# Altium schematic sheet DSPComm.SchDoc
size A4
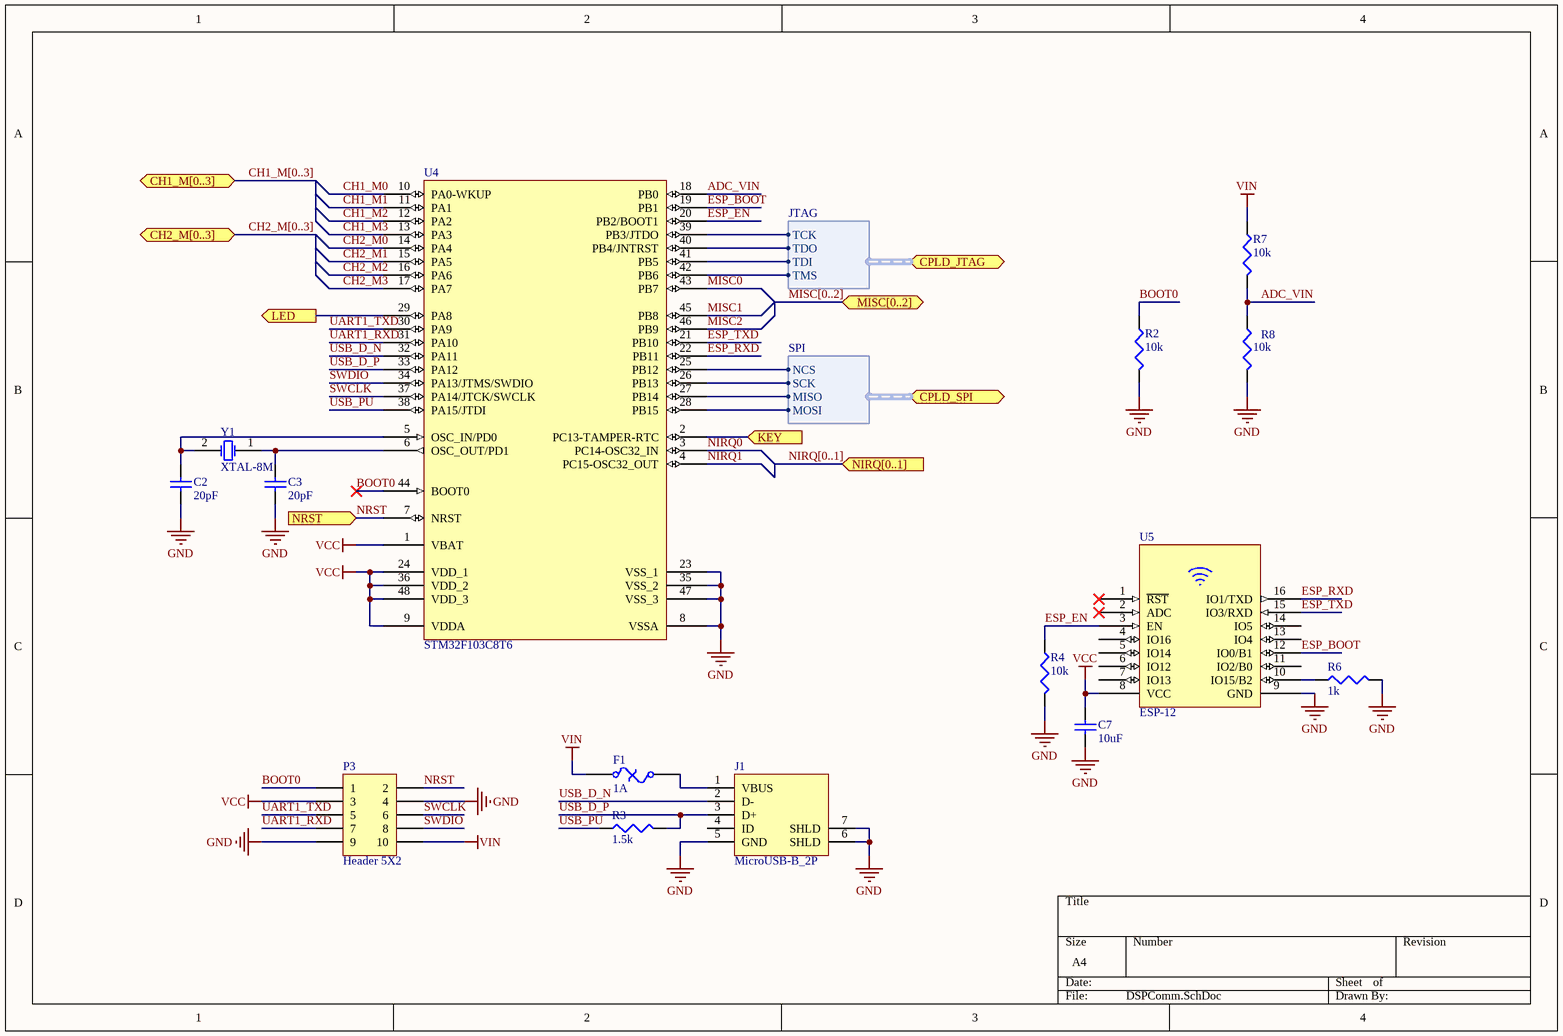
[diagram p0: DSPComm.SchDoc]

## Parts
C2  value 20pF  [0603C]  (hidden comment: Cap)
C3  value 20pF  [0603C]  (hidden comment: Cap)
C7  value 10uF  [0805C]  (hidden comment: Cap)
F1  1A  [1206F]
J1  MicroUSB-B_2P  [MICRO-USB-B-2P]
P3  Header 5X2  [HDR2X5]
R2  value 10k  [0603R]  (hidden comment: Res3)
R3  value 1.5k  [0603R]  (hidden comment: Res3)
R4  value 10k  [0603R]  (hidden comment: Res3)
R6  value 1k  [0603R]  (hidden comment: Res3)
R7  value 10k  [0603R]  (hidden comment: Res3)
R8  value 10k  [0603R]  (hidden comment: Res3)
U4  STM32F103C8T6  [LQFP48_M]
U5  ESP-12  [ESP-12]
Y1  XTAL-8M  [XTAL_5032_2P]

## Ports
CH1_M[0..3] (bidir), CH2_M[0..3] (bidir), CPLD_JTAG (harness JTAG), CPLD_SPI (harness SPI), KEY (in), LED (out), MISC[0..2] (bidir), NIRQ[0..1] (in), NRST (in)

## Harnesses
JTAG: TDI, TDO, TCK, TMS
SPI: MOSI, MISO, SCK, NCS

## Nets
GND: C2.1 C3.1 C7.2 J1.5(GND) J1.6(SHLD) J1.7(SHLD) P3.4 P3.9 R2.2 R4.2 R6.2 R8.2 U4.8(VSSA) U4.23(VSS_1) U4.35(VSS_2) U4.47(VSS_3) U5.9(GND)
VCC: C7.1 P3.3 U4.1(VBAT) U4.9(VDDA) U4.24(VDD_1) U4.36(VDD_2) U4.48(VDD_3) U5.8(VCC)
VIN: F1.1 P3.10 R7.1
ADC_VIN: R7.2 R8.1 U4.18(PB0)
BOOT0: P3.1 R2.1 U4.44(BOOT0)
CH1_M0: U4.10(PA0-WKUP)
CH1_M1: U4.11(PA1)
CH1_M2: U4.12(PA2)
CH1_M3: U4.13(PA3)
CH2_M0: U4.14(PA4)
CH2_M1: U4.15(PA5)
CH2_M2: U4.16(PA6)
CH2_M3: U4.17(PA7)
ESP_BOOT: U4.19(PB1) U5.12(IO0/B1)
ESP_EN: R4.1 U4.20(PB2/BOOT1) U5.3(EN)
ESP_RXD: U4.22(PB11) U5.16(IO1/TXD)
ESP_TXD: U4.21(PB10) U5.15(IO3/RXD)
KEY: U4.2(PC13-TAMPER-RTC) ; port KEY
LED: U4.29(PA8) ; port LED
MISC0: U4.43(PB7)
MISC1: U4.45(PB8)
MISC2: U4.46(PB9)
NIRQ0: U4.3(PC14-OSC32_IN)
NIRQ1: U4.4(PC15-OSC32_OUT)
NRST: P3.2 U4.7(NRST) ; port NRST
SWCLK: P3.6 U4.37(PA14/JTCK/SWCLK)
SWDIO: P3.8 U4.34(PA13/JTMS/SWDIO)
UART1_RXD: P3.7 U4.31(PA10)
UART1_TXD: P3.5 U4.30(PA9)
USB_D_N: J1.2(D-) U4.32(PA11)
USB_D_P: J1.3(D+) R3.2 U4.33(PA12)
USB_PU: R3.1 U4.38(PA15/JTDI)
NetC2_2: C2.2 U4.5(OSC_IN/PD0) Y1.2(OSC2)
NetC3_2: C3.2 U4.6(OSC_OUT/PD1) Y1.1(OSC1)
NetF1_2: F1.2 J1.1(VBUS)
NetR6_1: R6.1 U5.10(IO15/B2)
NetU4_25: U4.25(PB12) ; port CPLD_SPI.NCS
NetU4_26: U4.26(PB13) ; port CPLD_SPI.SCK
NetU4_27: U4.27(PB14) ; port CPLD_SPI.MISO
NetU4_28: U4.28(PB15) ; port CPLD_SPI.MOSI
NetU4_39: U4.39(PB3/JTDO) ; port CPLD_JTAG.TCK
NetU4_40: U4.40(PB4/JNTRST) ; port CPLD_JTAG.TDO
NetU4_41: U4.41(PB5) ; port CPLD_JTAG.TDI
NetU4_42: U4.42(PB6) ; port CPLD_JTAG.TMS

Not connected (* = marked no-connect by the designer): J1 4(ID); U5 1(~{RST})* 2(ADC)* 4(IO16) 5(IO14) 6(IO12) 7(IO13) 11(IO2/B0) 13(IO4) 14(IO5)

## Buses and harness runs
bus CH1_M[0..3] = port CH1_M[0..3]
bus CH2_M[0..3] = port CH2_M[0..3]
bus MISC[0..2] = port MISC[0..2]
bus NIRQ[0..1] = port NIRQ[0..1]

## Library data of the parts
C2 C3 C7 = Cap: Capacitor; Published: 8-Jun-2000; LatestRevisionDate: 17-Jul-2002; LatestRevisionNote: Re-released for DXP Platform.; PackageReference: CAPC2012L; Publisher: Altium Limited
F1 = Fuse Thermal: Thermal Fuse; Published: 24-Mar-1999; LatestRevisionDate: 17-Jul-2002; LatestRevisionNote: Re-released for DXP Platform.; PackageReference: PIN-W2/E2.8; Publisher: Altium Limited; PackageDescription: Thru-Hole; 2 Leads
J1 = MicroUSB-B_2P: MicroUSB母座
P3 = Header 5X2: Header, 5-Pin, Dual row; LatestRevisionDate: 17-Jul-2002; LatestRevisionNote: Re-released for DXP Platform.; Publisher: Altium Limited
R2-R4 R6-R8 = Res3: Resistor; Published: 8-Jun-2000; LatestRevisionDate: 29-May-2009; LatestRevisionNote: IPC-7351 Footprint Added.; PackageReference: J1-0603; Publisher: Altium Limited; PackageDescription: Chip Resistor
U4 = STM32F103C8T6: STM32 ARM-based 32-bit MCU with 64 Kbytes Flash, 48-pin LQFP, Industrial Temperature; Published: 30-May-2008; DatasheetVersion: rev6, Mar-2008; PackageVersion: Mar-2008; PackageReference: LQFP48; Publisher: Altium Limited; PackageDescription: 48-Pin Low-Profile Quad Flat Pack, 7 x 7 mm Body, 0.5 mm Pitch (LQFP48); ComponentLink1Description: Manufacturer Link; ComponentLink1URL: www.st.com/stm32; ComponentLink2Description: Datasheet; ComponentLink2URL: http://www.st.com/stonline/products/literature/ds/13587.pdf
U5 = ESP-12: 串口Wifi模块
Y1 = XTAL: Crystal Oscillator; Published: 8-Jun-2000; LatestRevisionDate: 17-Jul-2002; LatestRevisionNote: Re-released for DXP Platform.; PackageReference: R38; Publisher: Altium Limited; PackageDescription: Crystal, Thru-Hole; 2 Leads; Body 3.1 x 8.2 mm (Dia.xH)